# EAGLE design algyan_8th.es (EAGLE 7.7.0)
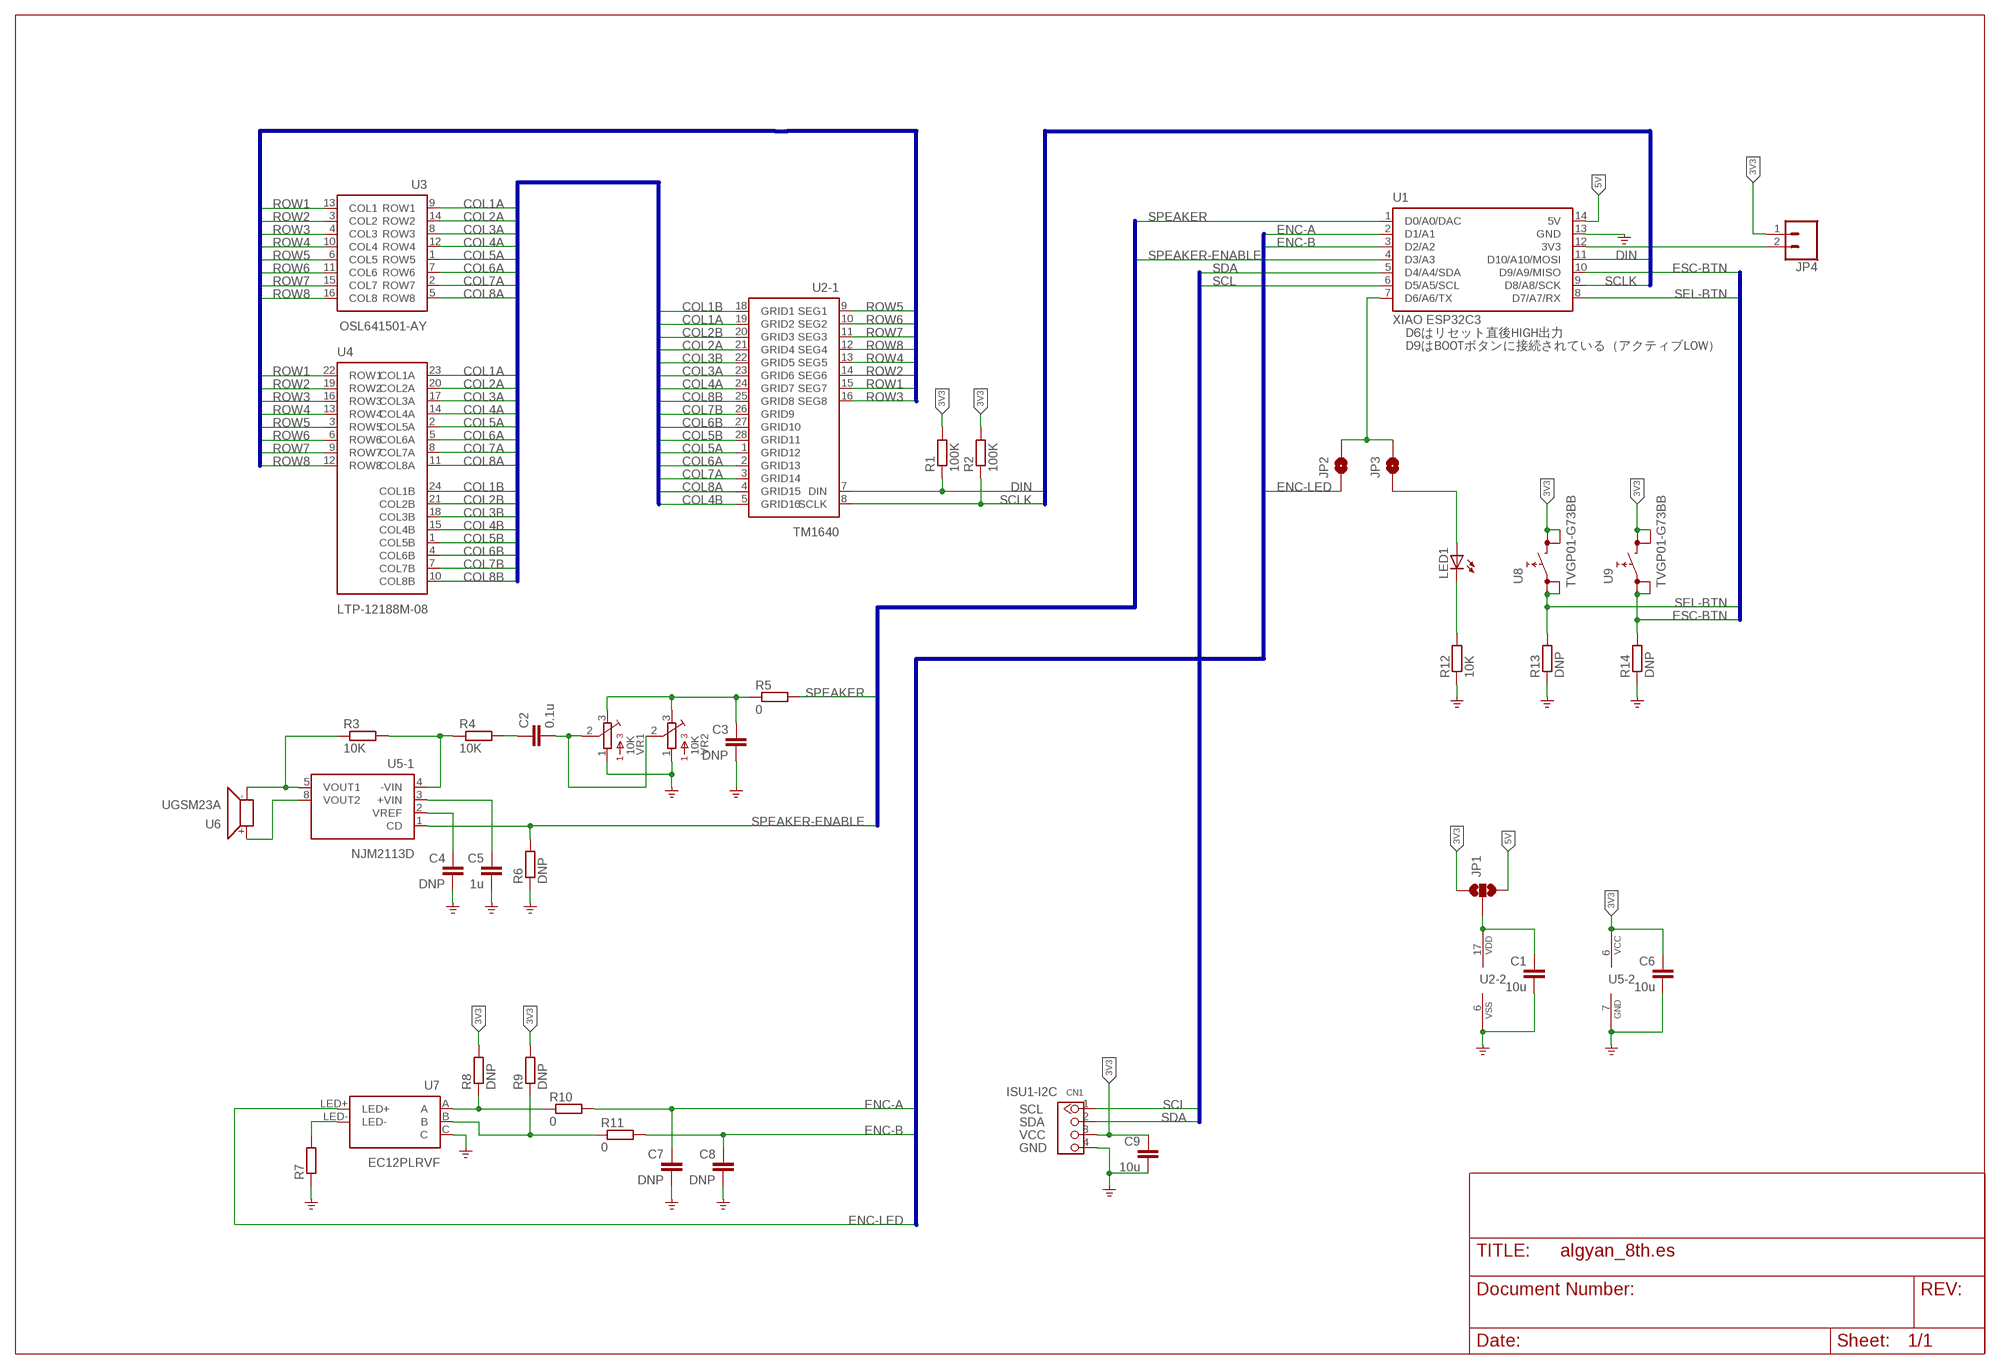
[diagram p0: schematic, sheet 1]

## Parts
C1  10u  C-EUC0805  [C0805]
C2  0.1u  C-EUC0603  [C0603]
C3  DNP  C-EUC0805  [C0805]
C4  DNP  C-EUC0805  [C0805]
C5  1u  C-EUC0805  [C0805]
C6  10u  C-EUC0805  [C0805]
C7  DNP  C-EUC0603  [C0603]
C8  DNP  C-EUC0603  [C0603]
C9  10u  C-EUC0805  [C0805]
CN1  4P-2.0  GROVE-CONNECTOR-DIP(4P-2.0)  [HW4-2.0]
JP1  JUMPER-SMT_3_NO_SILK  [SMT-JUMPER_3_NO_SILK]
JP2  JUMPER-SMT_2_NO_SILK  [SMT-JUMPER_2_NO_SILK]
JP3  JUMPER-SMT_2_NO_SILK  [SMT-JUMPER_2_NO_SILK]
JP4  CONN_02  [1X02]
LED1  LED5MM  [LED5MM]
R1  100K  R-EU_R0603  [R0603]
R2  100K  R-EU_R0603  [R0603]
R3  10K  R-EU_R0603  [R0603]
R4  10K  R-EU_R0603  [R0603]
R5  0  R-EU_R0603  [R0603]
R6  DNP  R-EU_R0603  [R0603]
R7  R-EU_R0603  [R0603]
R8  DNP  R-EU_R0603  [R0603]
R9  DNP  R-EU_R0603  [R0603]
R10  0  R-EU_R0603  [R0603]
R11  0  R-EU_R0603  [R0603]
R12  10K  R-EU_R0603  [R0603]
R13  DNP  R-EU_R0603  [R0603]
R14  DNP  R-EU_R0603  [R0603]
U1  XIAO ESP32C3  SEEEDUINOXIAO  [SEEEDUINOXIAO]
U2  TM1640  [TM1640]
U3  OSL641501-AY  [OSL641501]
U4  LTP-12188M-08  [LTP-12188M]
U5  NJM2113D  [DIL08]
U6  UGSM23A  [UGSM23A]
U7  EC12PLRVF  [EC12PLRVF]
U8  TVGP01-G73BB  [TVGP01-G73BB]
U9  TVGP01-G73BB  [TVGP01-G73BB]
VR1  10K  3386-K  [3386K]
VR2  10K  3386-T  [3386T]

## Nets
3V3: C6.1 C9.1 CN1.3 JP1.1 JP4.1 R1.2 R2.2 R8.2 R9.2 U5.6(-2:VCC) U8.3 U8.4 U9.3 U9.4
5V: JP1.3 U1.14(5V)
COL1A: U2.19(-1:GRID2) U3.9(ROW1) U4.23(COL1A)
COL1B: U2.18(-1:GRID1) U4.24(COL1B)
COL2A: U2.21(-1:GRID4) U3.14(ROW2) U4.20(COL2A)
COL2B: U2.20(-1:GRID3) U4.21(COL2B)
COL3A: U2.23(-1:GRID6) U3.8(ROW3) U4.17(COL3A)
COL3B: U2.22(-1:GRID5) U4.18(COL3B)
COL4A: U2.24(-1:GRID7) U3.12(ROW4) U4.14(COL4A)
COL4B: U2.5(-1:GRID16) U4.15(COL4B)
COL5A: U2.1(-1:GRID12) U3.1(ROW5) U4.2(COL5A)
COL5B: U2.28(-1:GRID11) U4.1(COL5B)
COL6A: U2.2(-1:GRID13) U3.7(ROW6) U4.5(COL6A)
COL6B: U2.27(-1:GRID10) U4.4(COL6B)
COL7A: U2.3(-1:GRID14) U3.2(ROW7) U4.8(COL7A)
COL7B: U2.26(-1:GRID9) U4.7(COL7B)
COL8A: U2.4(-1:GRID15) U3.5(ROW8) U4.11(COL8A)
COL8B: U2.25(-1:GRID8) U4.10(COL8B)
DIN: R1.1 U1.11(D10/A10/MOSI) U2.7(-1:DIN)
ENC-A: C7.1 R10.2 U1.2(D1/A1)
ENC-B: C8.1 R11.2 U1.3(D2/A2)
ENC-LED: JP2.1 U7.LED+
ESC-BTN: R14.2 U1.10(D9/A9/MISO) U9.1 U9.2
GND: C1.2 C3.2 C4.2 C5.2 C6.2 C7.2 C8.2 C9.2 CN1.4 R6.1 R7.1 R12.1 R13.1 R14.1 U1.13(GND) U2.6(-2:VSS) U5.7(-2:GND) U7.C VR1.1 VR2.1 ; supply symbol labelled GND_POWER
LED: JP3.1 LED1.A
N$1: R3.1 U5.5(-1:VOUT1) U6.-
N$2: R3.2 R4.1 U5.4(-1:-VIN)
N$3: U5.8(-1:VOUT2) U6.+
N$4: C2.1 R4.2
N$5: C5.1 U5.3(-1:+VIN)
N$6: C4.1 U5.2(-1:VREF)
N$7: R8.1 R10.1 U7.A
N$8: C2.2 VR1.2 VR2.2
N$9: R9.1 R11.1 U7.B
N$10: C3.1 R5.1 VR1.3 VR2.3
N$11: LED1.K(C) R12.2
N$12: JP2.2 JP3.2 U1.7(D6/A6/TX)
N$13: C1.1 JP1.2 U2.17(-2:VDD)
N$14: R7.2 U7.LED-
N$15: JP4.2 U1.12(3V3)
ROW1: U2.15(-1:SEG7) U3.13(COL1) U4.22(ROW1)
ROW2: U2.14(-1:SEG6) U3.3(COL2) U4.19(ROW2)
ROW3: U2.16(-1:SEG8) U3.4(COL3) U4.16(ROW3)
ROW4: U2.13(-1:SEG5) U3.10(COL4) U4.13(ROW4)
ROW5: U2.9(-1:SEG1) U3.6(COL5) U4.3(ROW5)
ROW6: U2.10(-1:SEG2) U3.11(COL6) U4.6(ROW6)
ROW7: U2.11(-1:SEG3) U3.15(COL7) U4.9(ROW7)
ROW8: U2.12(-1:SEG4) U3.16(COL8) U4.12(ROW8)
SCL: CN1.1 U1.6(D5/A5/SCL)
SCLK: R2.1 U1.9(D8/A8/SCK) U2.8(-1:SCLK)
SDA: CN1.2 U1.5(D4/A4/SDA)
SEL-BTN: R13.2 U1.8(D7/A7/RX) U8.1 U8.2
SPEAKER: R5.2 U1.1(D0/A0/DAC)
SPEAKER-ENABLE: R6.2 U1.4(D3/A3) U5.1(-1:CD)

## Buses
DIN,SCLK
COL1A,COL2A,COL3A,COL4A,COL5A,COL6A,COL7A,COL8A,COL1B,COL2B,COL3B,COL4B,COL5B,COL6B,COL7B,COL8B
ROW[1..8]
SPEAKER,SPEAKER_ENABLE
ENC-A,ENC-B,ENC-LED
SEL-BTN,ESC-BTN
SCL,SDA

## Notes on the sheet
- D6はリセット直後HIGH出力
- D9はBOOTボタンに接続されている（アクティブLOW）
- ISU1-I2C
- SCL
- SDA
- VCC
- GND

## Library data of the parts
C1-C9 = rcl:C-EU: CAPACITOR, European symbol
CN1 = Seeed-Connector:GROVE-CONNECTOR-DIP(4P-2.0): 320110033
JP1 = SparkFun-Jumpers:JUMPER-SMT_3_NO: Normally open jumper This jumper has three pads in close proximity to each other. Apply solder to close the connection(s).
JP2 JP3 = SparkFun-Jumpers:JUMPER-SMT_2_NO: Normally open jumper This jumper has two pads in close proximity to each other. Apply solder to close the connection. Round pads are easier to solder for beginners, but are a lot larger. SparkFun Product that uses the round pads: SparkFun EL Sequencer <https://www.sparkfun.com/products/12781>
JP4 = SparkFun-Connectors:CONN_02: Multi connection point. Often used as Generic Header-pin footprint for 0.1 inch spaced/style header connections On any of the 0.1 inch spaced packages, you can populate with these: Break Away Headers - Straight <https://www.sparkfun.com/products/116> (PRT-00116) Break Away Male Headers - Right Angle <https://www.sparkfun.com/products/553> (PRT-00553) Female Headers <https://www.sparkfun.com/products/115> (PRT-00115) Break Away Headers - Machine Pin <https://www.sparkfun.com/products/117> (PRT-00117) Break Away Female Headers - Swiss Machine Pin <https://www.sparkfun.com/products/743> (PRT-00743) For SCREWTERMINALS and SPRING TERMINALS visit here: Screw Terimnals on SparkFun.com <https://www.sparkfun.com/search/results?term=Screw+Terminals> (5mm/3.5mm/2.54mm spacing) This device is also useful as a general connection point to wire up your design to another part of your project. Our various solder wires solder well into these plated through hole pads. Hook-Up Wire - Assortment (Stranded, 22 AWG) <https://www.sparkfun.com/products/11375> (PRT-11375) Hook-Up Wire - Assortment (Solid Core, 22 AWG) <https://www.sparkfun.com/products/11367> (PRT-11367) View the entire wire category on our website here <https://www.sparkfun.com/categories/141> Special notes: Molex polarized connector foot print use with: PRT-08233 with associated crimp pins and housings. 2.54_SCREWTERM for use with PRT-10571. 3.5mm Screw Terminal footprints for PRT-08084 5mm Screw Terminal footprints for use with PRT-08432
LED1 = led:LED: LED OSRAM: - CHIPLED LG R971, LG N971, LY N971, LG Q971, LY Q971, LO R971, LY R971 LH N974, LH R974 LS Q976, LO Q976, LY Q976 LO Q996 - Hyper CHIPLED LW Q18S LB Q993, LB Q99A, LB R99A - SideLED LS A670, LO A670, LY A670, LG A670, LP A670 LB A673, LV A673, LT A673, LW A673 LH A674 LY A675 LS A676, LA A676, LO A676, LY A676, LW A676 LS A679, LY A679, LG A679 - Hyper Micro SIDELED® LS Y876, LA Y876, LO Y876, LY Y876 LT Y87S - SmartLED LW L88C, LW L88S LB L89C, LB L89S, LG L890 LS L89K, LO L89K, LY L89K LS L896, LA L896, LO L896, LY L896 - TOPLED LS T670, LO T670, LY T670, LG T670, LP T670 LSG T670, LSP T670, LSY T670, LOP T670, LYG T670 LG T671, LOG T671, LSG T671 LB T673, LV T673, LT T673, LW T673 LH T674 LS T676, LA T676, LO T676, LY T676, LB T676, LH T676, LSB T676, LW T676 LB T67C, LV T67C, LT T67C, LS T67K, LO T67K, LY T67K, LW E67C LS E67B, LA E67B, LO E67B, LY E67B, LB E67C, LV E67C, LT E67C LW T67C LS T679, LY T679, LG T679 LS T770, LO T770, LY T770, LG T770, LP T770 LB T773, LV T773, LT T773, LW T773 LH T774 LS E675, LA E675, LY E675, LS T675 LS T776, LA T776, LO T776, LY T776, LB T776 LHGB T686 LT T68C, LB T68C - Hyper Mini TOPLED® LB M676 - Mini TOPLED Santana® LG M470 LS M47K, LO M47K, LY M47K Source: http://www.osram.convergy.de LUXEON: - LUMILED® LXK2-PW12-R00, LXK2-PW12-S00, LXK2-PW14-U00, LXK2-PW14-V00 LXK2-PM12-R00, LXK2-PM12-S00, LXK2-PM14-U00 LXK2-PE12-Q00, LXK2-PE12-R00, LXK2-PE12-S00, LXK2-PE14-T00, LXK2-PE14-U00 LXK2-PB12-K00, LXK2-PB12-L00, LXK2-PB12-M00, LXK2-PB14-N00, LXK2-PB14-P00, LXK2-PB14-Q00 LXK2-PR12-L00, LXK2-PR12-M00, LXK2-PR14-Q00, LXK2-PR14-R00 LXK2-PD12-Q00, LXK2-PD12-R00, LXK2-PD12-S00 LXK2-PH12-R00, LXK2-PH12-S00 LXK2-PL12-P00, LXK2-PL12-Q00, LXK2-PL12-R00 Source: www.luxeon.com KINGBRIGHT: KA-3528ASYC Source: www.kingbright.com
R1-R14 = rcl:R-EU_: RESISTOR, European symbol
U1 = matsujirushi:SEEEDUINOXIAO
U2 = matsujirushi:TM1640; OC_AKIZUKI: I-13225
U3 = matsujirushi:OSL641501; OC_AKIZUKI: I-07662
U4 = matsujirushi:LTP-12188M; OC_AKIZUKI: I-09878
U5 = matsujirushi:NJM2113; OC_AKIZUKI: I-11192
U6 = matsujirushi:UGSM23A; OC_AKIZUKI: P-09797
U7 = matsujirushi:EC12PL*VF; OC_AKIZUKI: P-05762
U8 U9 = matsujirushi:TVGP01-G73BB; OC_AKIZUKI: P-12226
VR1 VR2 = pot-suntan:3386-: Trimming Potentiometer Suntan TSR-3386 Series 8 Terminal Square Trimming Potentiometer

## Board
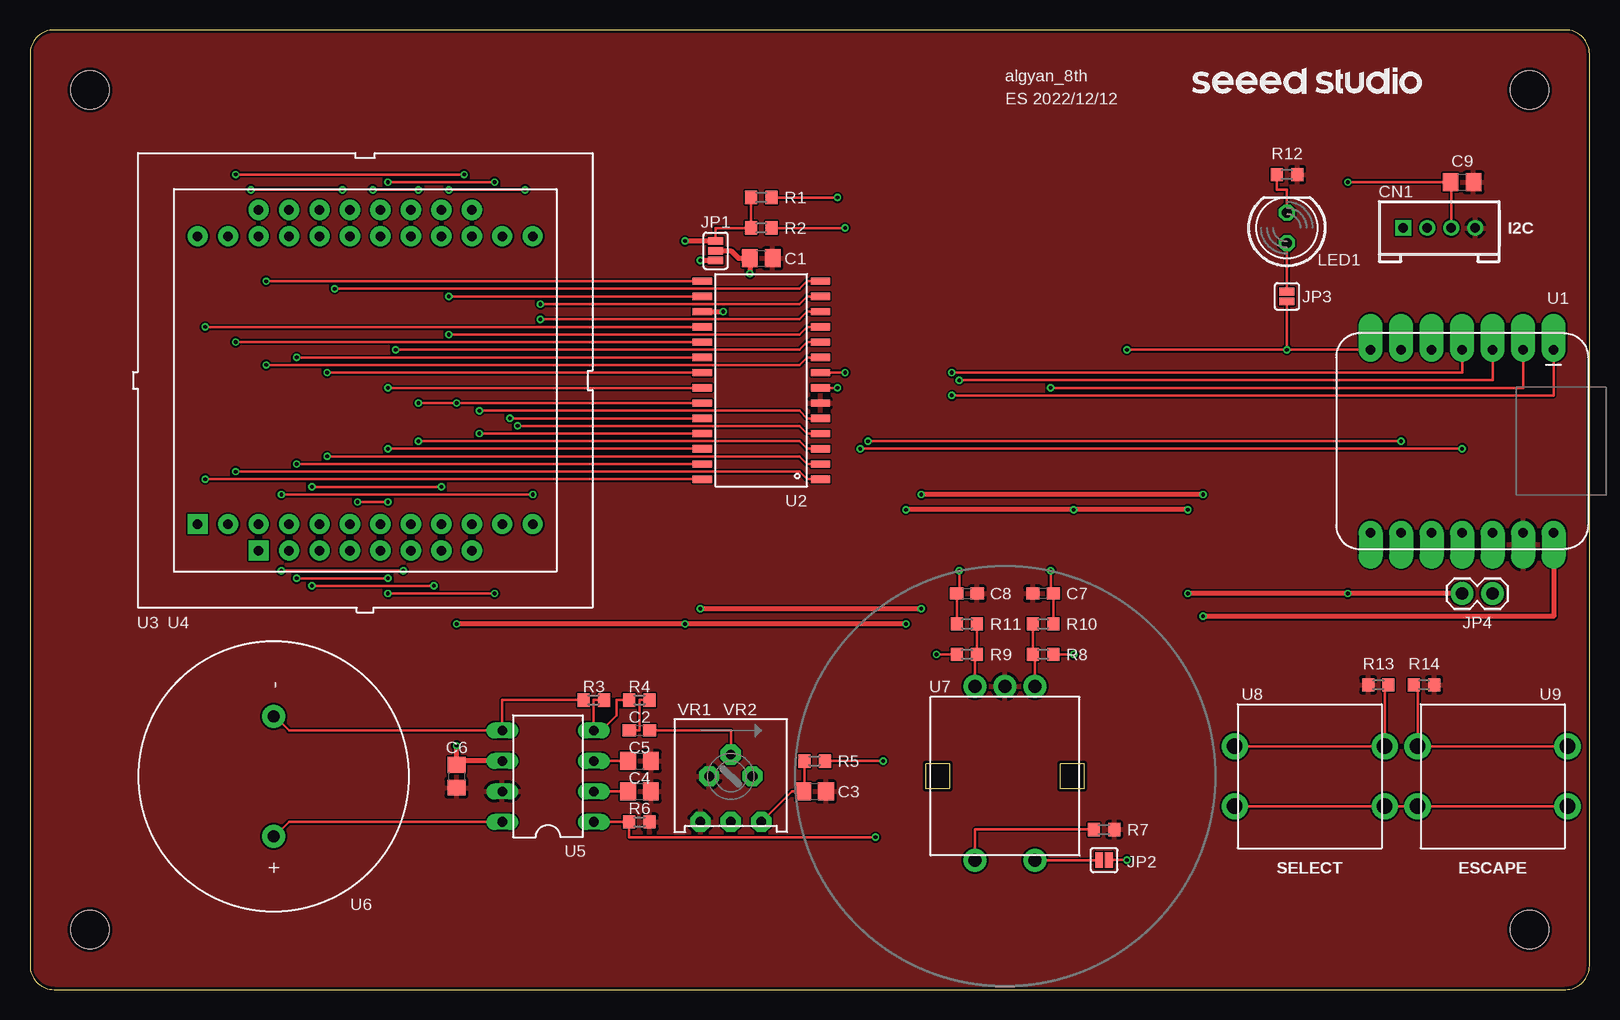
[diagram p1: board, top side]
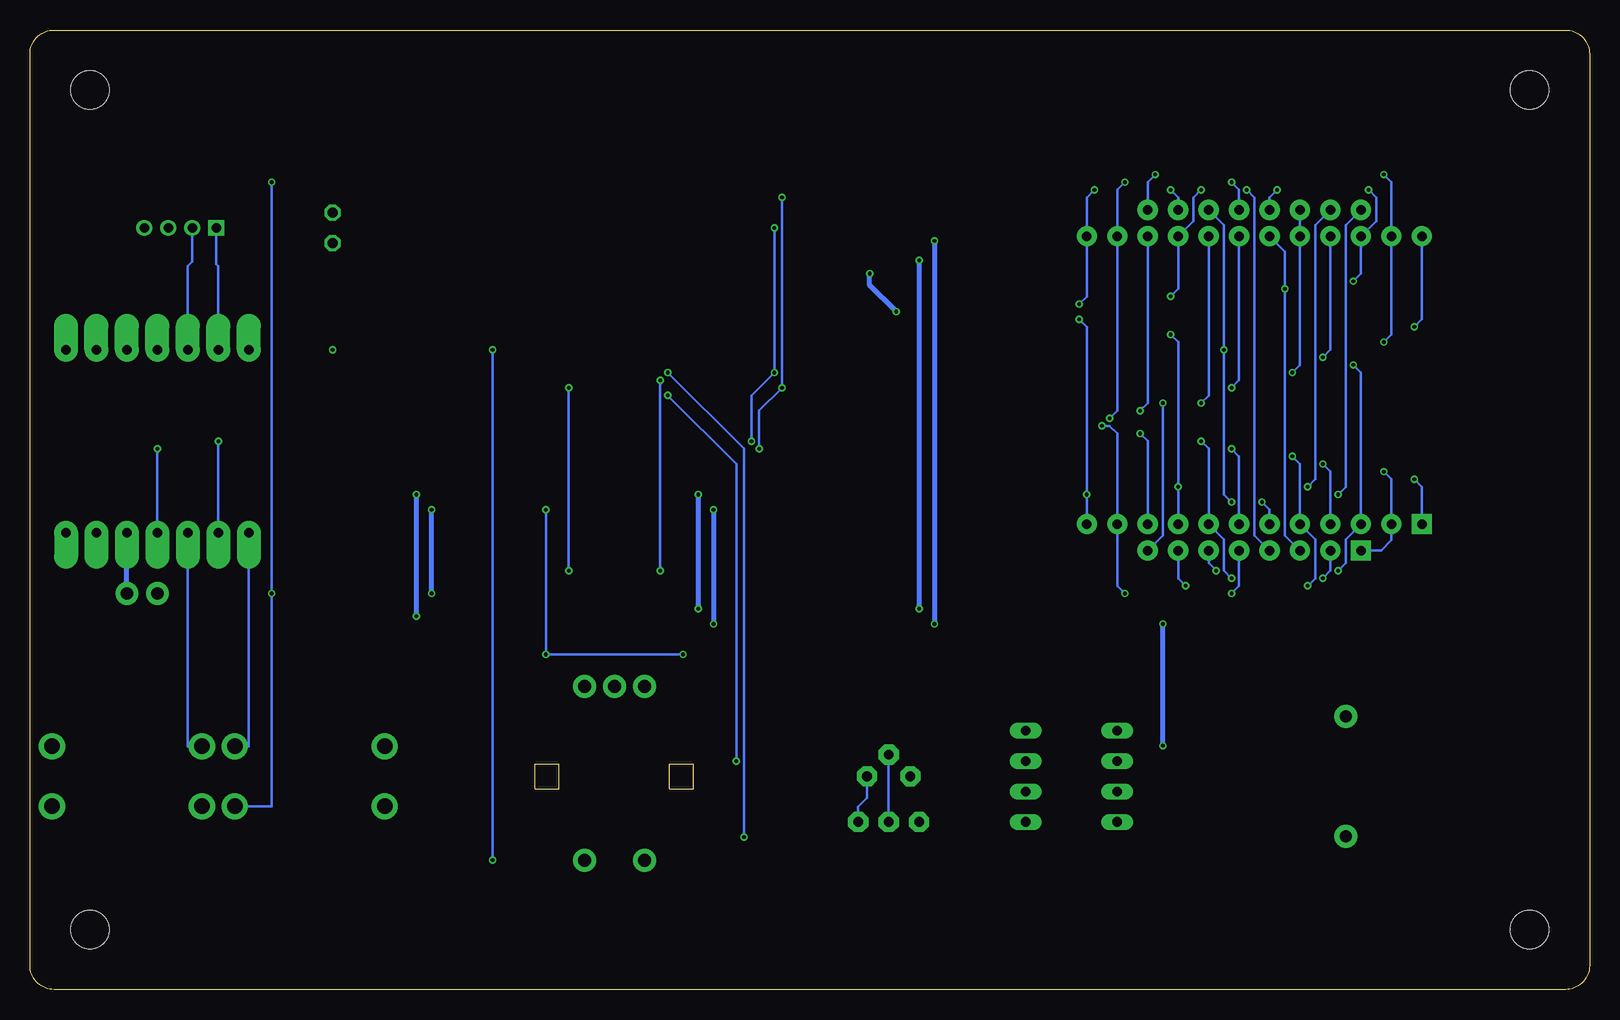
[diagram p2: board, bottom side, seen from below]

Size 130 x 80 mm. Coordinates in mm from the lower left corner, seen from the top.
Outline: 0,78 0,2 arc90 2,0 128,0 arc90 130,2 130,78 arc90 128,80 2,80 arc90 0,78
Copper layers (1*16): Top 0.035mm / dielectric 1.5mm / Bottom 0.035mm
Design rules "SeeedStudio_2layer_DRU_no_angle_20140221": minimum track width 6mil, minimum drill 12mil, track to track 6mil, track to pad 6mil, pad to pad 6mil, via to via 6mil, smd to smd 0mil, copper to edge 10mil, drill to drill 10mil, minimum pad ring 10mil, minimum via ring 6mil, stop-mask expansion 2mil, vias tented up to drill 100mil, thermal gap 10mil
Holes 3.2 mm at 5,5 5,75 125,75 125,5

### Footprints (pad centres in the part's own frame; a part is rotated, then mirrored left to right if it is on the bottom)
C0805 = smd 1.3 x 1.5: 1 -0.95,0; 2 0.95,0
C0603 = smd 1.1 x 1: 1 -0.85,0; 2 0.85,0
HW4-2.0 = drill 0.8 pad 1.27 square: 1 -3,0 | drill 0.8 pad 1.27: 2 -1,0; 3 1,0; 4 3,0
SMT-JUMPER_3_NO_SILK = smd 0.635 x 1.27: 1 -0.813,0; 2 0,0; 3 0.813,0
SMT-JUMPER_2_NO_SILK = smd 0.635 x 1.27: 1 -0.406,0; 2 0.406,0
1X02 = drill 1.016 pad 1.88: 1 0,0; 2 2.54,0
LED5MM = drill 0.813 octagon: A -1.27,0; K 1.27,0
R0603 = smd 1 x 1.1: 1 -0.85,0; 2 0.85,0
SEEEDUINOXIAO = drill 0.8 pad 2 offset: 1 -7.62,7.62; 2 -7.62,5.08; 3 -7.62,2.54; 4 -7.62,0; 5 -7.62,-2.54; 6 -7.62,-5.08; 7 -7.62,-7.62; 8 7.62,-7.62; 9 7.62,-5.08; 10 7.62,-2.54; 11 7.62,0; 12 7.62,2.54; 13 7.62,5.08; 14 7.62,7.62
TM1640 = smd 0.6 x 1.6: 1 -8.255,-4.925; 2 -6.985,-4.925; 3 -5.715,-4.925; 4 -4.445,-4.925; 5 -3.175,-4.925; 6 -1.905,-4.925; 7 -0.635,-4.925; 8 0.635,-4.925; 9 1.905,-4.925; 10 3.175,-4.925; 11 4.445,-4.925; 12 5.715,-4.925; 13 6.985,-4.925; 14 8.255,-4.925; 15 8.255,4.925; 16 6.985,4.925; 17 5.715,4.925; 18 4.445,4.925; 19 3.175,4.925; 20 1.905,4.925; 21 0.635,4.925; 22 -0.635,4.925; 23 -1.905,4.925; 24 -3.175,4.925; 25 -4.445,4.925; 26 -5.715,4.925; 27 -6.985,4.925; 28 -8.255,4.925
OSL641501 = drill 0.8 pad 1.676 square: 1 -8.89,-14.2 | drill 0.8 pad 1.676: 2 -6.35,-14.2; 3 -3.81,-14.2; 4 -1.27,-14.2; 5 1.27,-14.2; 6 3.81,-14.2; 7 6.35,-14.2; 8 8.89,-14.2; 9 8.89,14.2; 10 6.35,14.2; 11 3.81,14.2; 12 1.27,14.2; 13 -1.27,14.2; 14 -3.81,14.2; 15 -6.35,14.2; 16 -8.89,14.2
LTP-12188M = drill 0.8 pad 1.676 square: 1 -13.97,-12 | drill 0.8 pad 1.676: 2 -11.43,-12; 3 -8.89,-12; 4 -6.35,-12; 5 -3.81,-12; 6 -1.27,-12; 7 1.27,-12; 8 3.81,-12; 9 6.35,-12; 10 8.89,-12; 11 11.43,-12; 12 13.97,-12; 13 13.97,12; 14 11.43,12; 15 8.89,12; 16 6.35,12; 17 3.81,12; 18 1.27,12; 19 -1.27,12; 20 -3.81,12; 21 -6.35,12; 22 -8.89,12; 23 -11.43,12; 24 -13.97,12
DIL08 = drill 0.813 long: 1 -3.81,-3.81; 2 -1.27,-3.81; 3 1.27,-3.81; 4 3.81,-3.81; 5 3.81,3.81; 6 1.27,3.81; 7 -1.27,3.81; 8 -3.81,3.81
UGSM23A = drill 1 pad 1.93: + 0,5; - 0,-5
EC12PLRVF = drill 1.1 pad 1.93: A -2.5,-7.5; B 2.5,-7.5; C 0,-7.5; LED+ -2.5,7; LED- 2.5,7
TVGP01-G73BB = drill 1.3 pad 2.184: 1 -6.25,2.5; 2 6.25,2.5; 3 -6.25,-2.5; 4 6.25,-2.5
3386K = drill 0.813 pad 1.676 octagon: 1 -1.8,0; 2 0,1.8; 3 1.8,0
3386T = drill 0.813 pad 1.676 octagon: 1 -2.54,-3.81; 2 0,-3.81; 3 2.54,-3.81

### Placement (x,y rotation side)
C1  60.96,60.96 0 top
C2  50.8,21.59 0 top
C3  65.41,16.51 0 top
C4  50.8,16.51 0 top
C5  50.8,19.05 0 top
C6  35.56,17.78 270 top
C7  84.45,33.02 180 top
C8  78.11,33.02 0 top
C9  119.38,67.31 0 top
CN1  117.47,63.5 0 top
JP1  57.15,61.59 270 top
JP2  89.53,10.79 0 top
JP3  104.78,57.78 270 top
JP4  119.38,33.02 0 top
LED1  104.78,63.5 90 top
R1  60.96,66.04 180 top
R2  60.96,63.5 180 top
R3  46.99,24.13 0 top
R4  50.8,24.13 0 top
R5  65.41,19.05 0 top
R6  50.8,13.97 180 top
R7  89.53,13.34 180 top
R8  84.45,27.94 0 top
R9  78.11,27.94 180 top
R10  84.45,30.48 0 top
R11  78.11,30.48 180 top
R12  104.78,67.94 180 top
R13  112.39,25.4 0 top
R14  116.2,25.4 180 top
U1  119.38,45.72 270 top
U2  60.96,50.8 90 top
U3  27.94,50.8 0 top
U4  27.94,50.8 0 top
U5  43.18,17.78 90 top
U6  20.32,17.78 180 top
U7  81.28,17.78 180 top
U8  106.68,17.78 0 top
U9  121.92,17.78 0 top
VR1  58.42,17.78 0 top
VR2  58.42,17.78 0 top

### Tracks (layer width: path | path; a pad name or v marks a point on that pad's centre or on a via)
3V3  (via drill 0.3)
  Top 0.203: R1.2 R2.2 57.15,63.5 JP1.1 | R9.2 v75.56,27.94 | v87,27.94 R8.2 | U8.3 U8.4 U9.3 U9.4 | v109.86,67.31 C9.1 118.47,67.27 CN1.3
  Top 0.406: v35.56,20.32 C6.1 35.56,19.05 U5.6 | JP4.1 v109.86,33.02 v96.52,33.02 | v96.52,40.01 v87,40.01 v73.03,40.01 | v73.03,30.48 v54.61,30.48 v35.56,30.48 | JP1.1 v54.61,62.41
  Bottom 0.203: v75.56,27.94 v87,27.94 v87,40.01 | U8.4 109.86,15.28 v109.86,33.02 v109.86,67.31
  Bottom 0.406: v35.56,20.32 v35.56,30.48 | v96.52,33.02 v96.52,40.01 | v73.03,40.01 v73.03,30.48 | v54.61,62.41 v54.61,30.48
5V  (via drill 0.3)
  Top 0.406: U1.14 127,31.11 v97.79,31.11 | v97.79,41.27 v74.3,41.27 | v74.3,31.75 v55.88,31.75 | JP1.3 v55.88,60.78
  Bottom 0.406: v97.79,31.11 v97.79,41.27 | v74.3,41.27 v74.3,31.75 | v55.88,60.78 v55.88,31.75
COL1A  (via drill 0.3)
  Top 0.203: v36.2,67.94 v17.14,67.94 | U2.19 v17.14,53.98
  Bottom 0.203: U3.9 36.83,67.31 v36.2,67.94 | v17.14,53.98 16.51,54.61 U4.23 16.51,67.31 v17.14,67.94
COL1B  (via drill 0.3)
  Top 0.203: v14.61,55.24 U2.18
  Bottom 0.203: U4.24 13.97,55.88 v14.61,55.24
COL2A  (via drill 0.3)
  Top 0.203: v24.77,51.44 U2.21
  Bottom 0.203: U3.14 U4.20 24.13,52.07 v24.77,51.44
COL2B  (via drill 0.3)
  Top 0.203: v22.23,52.7 U2.20
  Bottom 0.203: U4.21 21.59,53.34 v22.23,52.7
COL3A  (via drill 0.3)
  Top 0.203: v32.38,48.9 v35.56,48.9 U2.23
  Bottom 0.203: U3.8 35.56,37.87 v35.56,48.9 | v32.38,48.9 31.75,49.53 U4.17
COL3B  (via drill 0.3)
  Top 0.203: v29.84,50.16 U2.22
  Bottom 0.203: U4.18 29.21,50.8 v29.84,50.16
COL4A  (via drill 0.3)
  Top 0.203: v29.84,67.31 v38.73,67.31 | v40.01,47.62 U2.24
  Bottom 0.203: U3.12 29.21,66.67 v29.84,67.31 | v38.73,67.31 39.37,66.67 U4.14 39.37,48.26 v40.01,47.62
COL4B  (via drill 0.3)
  Top 0.203: v37.47,48.26 64.14,48.26 64.77,47.62 U2.5
  Bottom 0.203: U4.15 36.83,48.9 v37.47,48.26
COL5A  (via drill 0.3)
  Top 0.203: v17.14,43.18 64.14,43.18 64.77,42.55 U2.1
  Bottom 0.203: v17.14,43.18 16.51,42.55 U4.2 16.51,37.47 17.38,36.6 U3.1
COL5B  (via drill 0.3)
  Top 0.203: v14.61,42.55 U2.28
  Bottom 0.203: U4.1 13.97,41.91 v14.61,42.55
COL6A  (via drill 0.3)
  Top 0.203: v33.66,33.66 v23.5,33.66 | v24.77,44.45 64.14,44.45 64.77,43.81 U2.2
  Bottom 0.203: U3.7 34.29,34.29 v33.66,33.66 | v23.5,33.66 22.86,34.29 22.86,37.53 U4.5 24.13,43.81 v24.77,44.45
COL6B  (via drill 0.3)
  Top 0.203: v22.23,43.81 U2.27
  Bottom 0.203: U4.4 21.59,43.18 v22.23,43.81
COL7A  (via drill 0.3)
  Top 0.203: v22.23,34.29 v29.84,34.29 | v32.38,45.72 64.14,45.72 64.77,45.09 U2.3
  Bottom 0.203: U3.2 21.59,34.92 v22.23,34.29 | v29.84,34.29 30.48,34.92 30.48,37.53 U4.8 31.75,45.09 v32.38,45.72
COL7B  (via drill 0.3)
  Top 0.203: v29.84,45.09 U2.26
  Bottom 0.203: U4.7 29.21,44.45 v29.84,45.09
COL8A  (via drill 0.3)
  Top 0.203: v29.84,33.02 v38.73,33.02 | v40.64,46.99 64.14,46.99 64.77,46.35 U2.4
  Bottom 0.203: U3.5 29.21,33.66 v29.84,33.02 | v38.73,33.02 39.37,33.66 U4.11 39.37,46.35 40.01,46.99 v40.64,46.99
COL8B  (via drill 0.3)
  Top 0.203: v37.47,46.35 U2.25
  Bottom 0.203: U4.10 36.83,45.72 v37.47,46.35
DIN  (via drill 0.3)
  Top 0.203: R1.1 v67.31,66.04 | v67.31,50.16 U2.7 | v69.22,45.09 v119.38,45.09
  Bottom 0.203: v67.31,66.04 v67.31,50.16 69.22,48.26 v69.22,45.09 | v119.38,45.09 U1.11
ENC-A  (via drill 0.3)
  Top 0.203: R10.2 C7.1 85.09,33.02 v85.09,34.92 | v85.09,50.16 124.46,50.16 U1.2
  Bottom 0.203: v85.09,34.92 v85.09,50.16
ENC-B  (via drill 0.3)
  Top 0.203: R11.2 C8.1 77.47,33.02 v77.47,34.92 | v77.47,50.8 121.92,50.8 U1.3
  Bottom 0.203: v77.47,34.92 v77.47,50.8
ENC-LED
  Top 0.203: U7.LED+ JP2.1
ESC-BTN
  Top 0.203: U9.2 U9.1 115.67,25.4 R14.2
  Bottom 0.203: U1.10 116.84,20.28 U9.1
GND
  pour Top: -2.54,81.28 132.08,81.28 132.08,-2.54 -2.54,-2.54 -2.54,80.64
LED
  Top 0.203: LED1.A JP3.1
N$1
  Top 0.203: U6.- 20.4,22.78 21.59,21.59 U5.5 39.37,24.13 R3.1
N$2
  Top 0.203: R3.2 46.99,24.13 U5.4 47.62,21.59 48.9,22.86 48.9,24.13 R4.1
N$3
  Top 0.203: U6.+ 20.4,12.78 21.59,13.97 U5.8
N$4
  Top 0.203: R4.2 50.8,24.13 50.8,21.59 C2.1
N$5
  Top 0.203: U5.3 C5.1
N$6
  Top 0.203: U5.2 C4.1
N$7
  Top 0.203: U7.A 83.78,27.94 R8.1 R10.1
N$8
  Top 0.203: C2.2 58.42,21.59 VR1.2
  Bottom 0.203: VR1.2 VR2.2
N$9
  Top 0.203: U7.B 78.78,27.94 R9.1 R11.1
N$10
  Top 0.203: VR2.3 63.5,16.51 C3.1 64.56,16.61 R5.1
  Bottom 0.203: VR1.3 60.22,15.98 60.96,15.24 VR2.3
N$11
  Top 0.203: LED1.K 104.78,66.67 103.92,66.67 R12.2
N$12  (via drill 0.3)
  Top 0.203: JP2.2 v91.44,10.79 | v91.44,53.34 v104.78,53.34 | v104.78,53.34 U1.7 | JP3.2 v104.78,53.34
  Bottom 0.203: v91.44,10.79 v91.44,53.34
N$13  (via drill 0.3)
  Top 0.406: U2.17 v57.78,56.52 | JP1.2 58.42,61.59 59.05,60.96 C1.1 v60.01,59.69
  Bottom 0.406: v57.78,56.52 60.01,58.74 v60.01,59.69
N$14
  Top 0.203: R7.2 78.78,13.34 U7.LED-
N$15
  Bottom 0.406: JP4.2 U1.12
ROW1  (via drill 0.3)
  Top 0.203: v26.04,66.67 v18.41,66.67 | v19.68,59.05 U2.15
  Bottom 0.203: U3.13 26.67,66.04 v26.04,66.67 | v18.41,66.67 17.78,66.04 17.78,64.07 U4.22 19.05,59.69 v19.68,59.05
ROW2  (via drill 0.3)
  Top 0.203: v25.4,58.42 64.14,58.42 64.77,59.05 U2.14
  Bottom 0.203: U3.3 25.4,37.87 v25.4,58.42 25.4,61.53 U4.19
ROW3  (via drill 0.3)
  Top 0.203: v28.57,66.67 v32.38,66.67 | v34.92,57.78 U2.16
  Bottom 0.203: v28.57,66.67 27.94,66.04 27.94,37.87 U3.4 | v32.38,66.67 33.02,66.04 33.02,64.07 U4.16 34.29,58.42 v34.92,57.78
ROW4  (via drill 0.3)
  Top 0.203: v34.92,66.67 v41.27,66.67 | v42.55,57.15 64.14,57.15 64.77,57.78 U2.13
  Bottom 0.203: U3.10 34.29,66.04 v34.92,66.67 | v41.27,66.67 41.91,66.04 U4.13 41.91,57.78 v42.55,57.15
ROW5  (via drill 0.3)
  Top 0.203: v31.11,34.92 v20.95,34.92 | v19.68,52.07 64.14,52.07 64.77,52.7 U2.9
  Bottom 0.203: U3.6 31.75,35.56 v31.11,34.92 | v20.95,34.92 20.32,35.56 20.32,37.53 U4.3 19.05,51.44 v19.68,52.07
ROW6  (via drill 0.3)
  Top 0.203: v27.3,40.64 v29.84,40.64 | v30.48,53.34 64.14,53.34 64.77,53.98 U2.10
  Bottom 0.203: U3.11 30.48,63.73 v30.48,53.34 30.48,41.27 v29.84,40.64 | U4.6 26.67,40.01 v27.3,40.64
ROW7  (via drill 0.3)
  Top 0.203: v23.5,41.91 v34.29,41.91 | v34.92,54.61 64.14,54.61 64.77,55.24 U2.11
  Bottom 0.203: U3.15 22.86,63.73 22.86,42.55 v23.5,41.91 | U4.9 v34.29,41.91 34.29,53.98 v34.92,54.61
ROW8  (via drill 0.3)
  Top 0.203: v20.95,41.27 v41.91,41.27 | v42.55,55.88 64.14,55.88 64.77,56.52 U2.12
  Bottom 0.203: U3.16 20.32,63.73 20.32,41.91 v20.95,41.27 | U4.12 v41.91,41.27 41.91,55.24 v42.55,55.88
SCL
  Bottom 0.203: U1.6 114.3,60.33 114.47,60.5 CN1.1
SCLK  (via drill 0.3)
  Top 0.203: R2.1 v67.94,63.5 | v67.94,51.44 U2.8 | v69.85,45.72 v114.3,45.72
  Bottom 0.203: v69.85,45.72 69.85,49.53 v67.94,51.44 v67.94,63.5 | v114.3,45.72 U1.9
SDA
  Bottom 0.203: U1.5 116.84,60.33 116.47,60.69 CN1.2
SEL-BTN
  Top 0.203: U8.1 U8.2 112.93,25.4 R13.2
  Bottom 0.203: U1.8 111.76,20.28 U8.2
SPEAKER  (via drill 0.3)
  Top 0.203: R5.2 v71.12,19.05 | v76.83,49.53 127,49.53 U1.1
  Bottom 0.203: v71.12,19.05 71.12,43.81 v76.83,49.53
SPEAKER-ENABLE  (via drill 0.3)
  Top 0.203: U5.1 R6.2 49.95,12.7 v70.48,12.7 | v76.83,51.44 119.38,51.44 U1.4
  Bottom 0.203: v70.48,12.7 70.48,38.73 70.48,45.09 v76.83,51.44

### Text on the board
tPlace: algyan_8th | ES 2022/12/12 | I2C | SELECT | ESCAPE